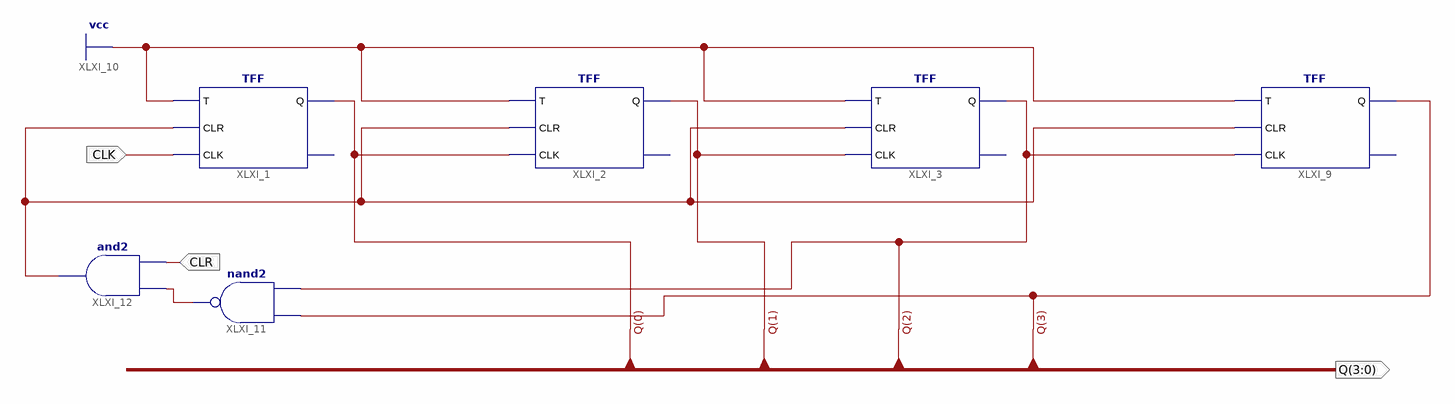
[diagram p0: schematic sheet 1]
// Xilinx ISE schematic MOD_10_COUNTER.sch (artix7) as structural Verilog: 6 symbols, 3 ports
module MOD_10_COUNTER (
  input  CLK,
  input  CLR,
  output [3:0] Q
);

  wire XLXN_18, XLXN_21;

  TFF XLXI_1 (.T(1'b1), .CLR(XLXN_21), .CLK(CLK), .Q(Q[0]));  // open: Qb
  TFF XLXI_2 (.T(1'b1), .CLR(XLXN_21), .CLK(Q[0]), .Q(Q[1]));  // open: Qb
  TFF XLXI_3 (.T(1'b1), .CLR(XLXN_21), .CLK(Q[1]), .Q(Q[2]));  // open: Qb
  TFF XLXI_9 (.T(1'b1), .CLR(XLXN_21), .CLK(Q[2]), .Q(Q[3]));  // open: Qb
  and XLXI_12 (XLXN_21, CLR, XLXN_18);
  nand XLXI_11 (XLXN_18, Q[2], Q[3]);
endmodule
